# Altium project Tegra_Dual_Camera.PrjPcb (part 1 of 3)
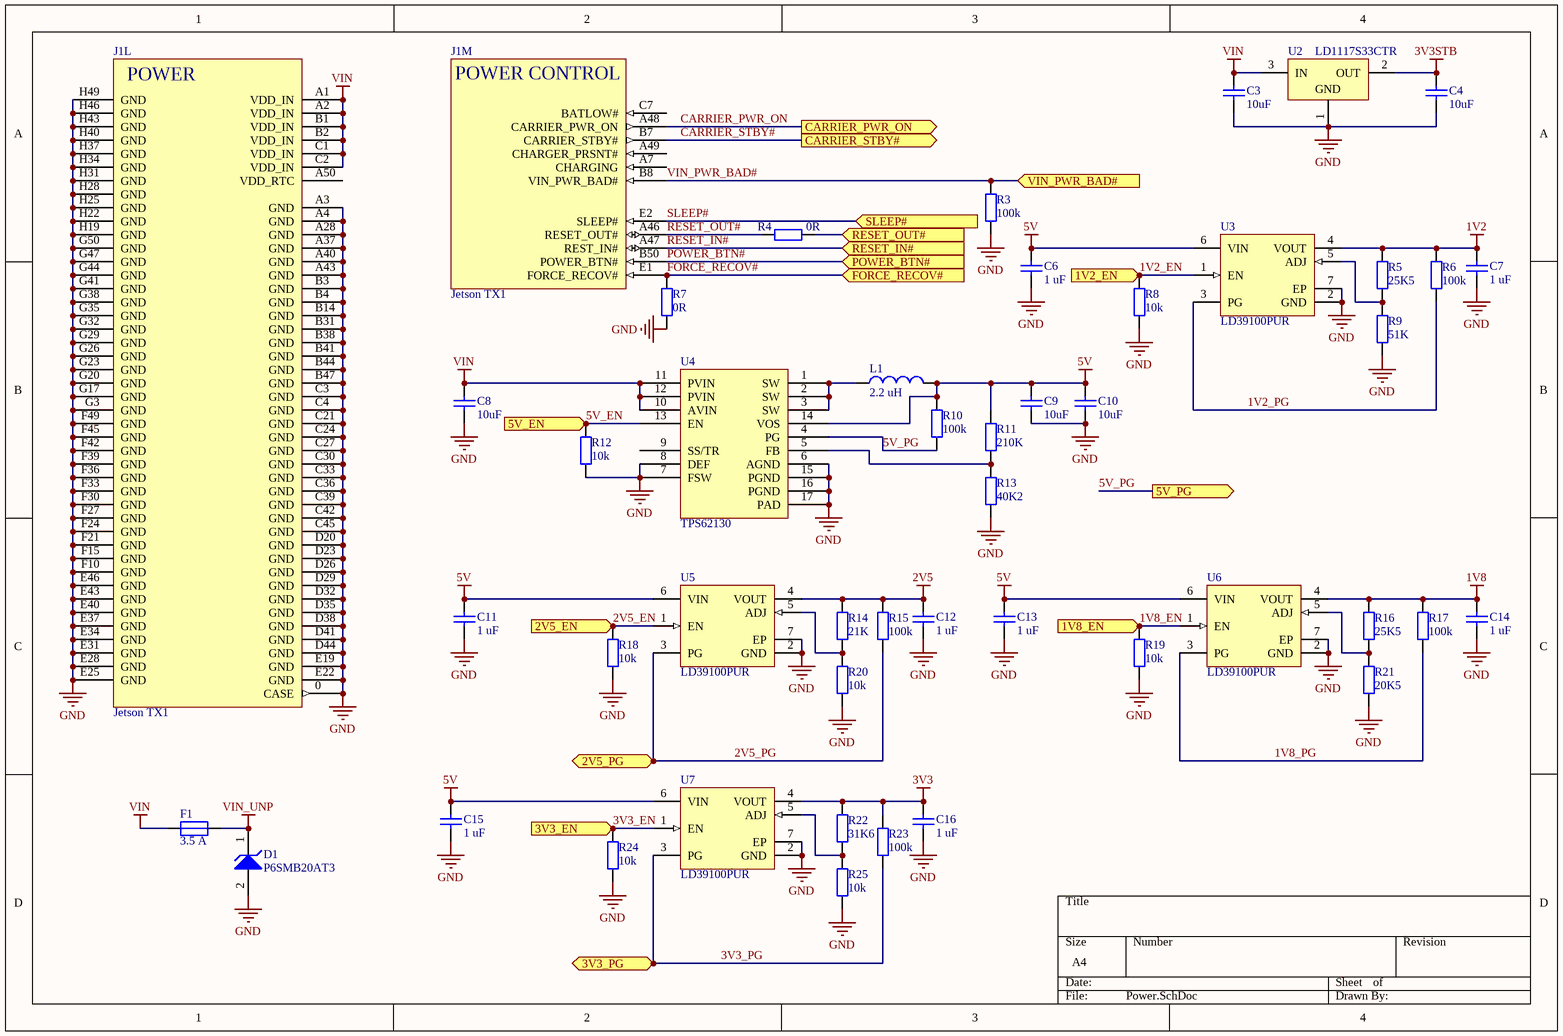
[diagram p0: Power.SchDoc]
16 sheets, 233 parts. Net scope: flat (ports and power ports of the same name join across sheets).
Board files: PCB.PcbDoc, Tegra_Dual_Camera_Panel.PcbDoc
Sheets:
  Power.SchDoc
  Not_Used.SchDoc
  Tegra_CSI.SchDoc
  SD_Card.SchDoc
  Ethernet.SchDoc
  Tegra_Serial.SchDoc
  MCU_CAN.SchDoc
  Debug_connectors.SchDoc
  USB.SchDoc
  Rail_discharge.SchDoc
  LWIR_Camera.SchDoc
  LWIR_FPGA_CSI.SchDoc
  LWIR_FPGA_Misc.SchDoc
  RGB_Camera.SchDoc
  RGB_FPGA_CSI.SchDoc
  RGB_FPGA_Misc.SchDoc

## Sheet Power.SchDoc
size A4

### Parts
C3  value 10uF  [1206_1.6_M]  (hidden comment: TMK316B7106KL-TD)
C4  value 10uF  [0603C_M]  (hidden comment: GRM188R60J106ME47D)
C6  Capacitance: 1 uF  [0603C_M]  (hidden comment: GRM188R61A105KA61D)
C7  Capacitance: 1 uF  [0603C_M]  (hidden comment: GRM188R61A105KA61D)
C8  value 10uF  [1206_1.6_M]  (hidden comment: TMK316B7106KL-TD)
C9  value 10uF  [0603C_M]  (hidden comment: GRM188R60J106ME47D)
C10  value 10uF  [0603C_M]  (hidden comment: GRM188R60J106ME47D)
C11  Capacitance: 1 uF  [0603C_M]  (hidden comment: GRM188R61A105KA61D)
C12  Capacitance: 1 uF  [0603C_M]  (hidden comment: GRM188R61A105KA61D)
C13  Capacitance: 1 uF  [0603C_M]  (hidden comment: GRM188R61A105KA61D)
C14  Capacitance: 1 uF  [0603C_M]  (hidden comment: GRM188R61A105KA61D)
C15  Capacitance: 1 uF  [0603C_M]  (hidden comment: GRM188R61A105KA61D)
C16  Capacitance: 1 uF  [0603C_M]  (hidden comment: GRM188R61A105KA61D)
D1  P6SMB20AT3  [ONSC-SMB-2-403A-03_J_V]
F1  Current Rating: 3.5 A  [0603R_0.45_M]  (hidden comment: 0603SFV350F/32-2)
J1  Jetson TX1  [Nvidia Jetson TX1]  (parts L,M of 14)
L1  Inductance: 2.2 uH  [XFL4020_M]  (hidden comment: XFL4020-222MEC)
R3  Resistance: 100k  [0402R_M]  (hidden comment: CRCW0402100KJNED)
R4  value 0R  [0402R_M]  (hidden comment: Generic resitor)
R5  value 25K5  [0402R_M]  (hidden comment: CRCW040225K5FKED)
R6  Resistance: 100k  [0402R_M]  (hidden comment: CRCW0402100KJNED)
R7  value 0R  [0402R_M]  (hidden comment: Generic resitor)
R8  value 10k  [0402R_M]  (hidden comment: CRCW040210K0FKED)
R9  value 51K  [0402R_M]  (hidden comment: CRCW040251K0FKED)
R10  Resistance: 100k  [0402R_M]  (hidden comment: CRCW0402100KJNED)
R11  value 210K  [0402R_M]  (hidden comment: CRCW0402210KFKED)
R12  value 10k  [0402R_M]  (hidden comment: CRCW040210K0FKED)
R13  value 40K2  [0402R_M]  (hidden comment: CRCW040240K2FKED)
R14  value 21K  [0402R_M]  (hidden comment: CRCW040221K0FKED)
R15  Resistance: 100k  [0402R_M]  (hidden comment: CRCW0402100KJNED)
R16  value 25K5  [0402R_M]  (hidden comment: CRCW040225K5FKED)
R17  Resistance: 100k  [0402R_M]  (hidden comment: CRCW0402100KJNED)
R18  value 10k  [0402R_M]  (hidden comment: CRCW040210K0FKED)
R19  value 10k  [0402R_M]  (hidden comment: CRCW040210K0FKED)
R20  value 10k  [0402R_M]  (hidden comment: CRCW040210K0FKED)
R21  value 20K5  [0402R_M]  (hidden comment: CRCW040220K5FKED)
R22  value 31K6  [0402R_M]  (hidden comment: CRCW040231K6FKED)
R23  Resistance: 100k  [0402R_M]  (hidden comment: CRCW0402100KJNED)
R24  value 10k  [0402R_M]  (hidden comment: CRCW040210K0FKED)
R25  value 10k  [0402R_M]  (hidden comment: CRCW040210K0FKED)
U2  LD1117S33CTR  [SOT-223_L]
U3  LD39100PUR  [DFN6D_M]
U4  TPS62130  [VQFN1_16_L]
U5  LD39100PUR  [DFN6D_M]
U6  LD39100PUR  [DFN6D_M]
U7  LD39100PUR  [DFN6D_M]

### Ports
1V2_EN (in), 1V8_EN (in), 2V5_EN (in), 2V5_PG (out), 3V3_EN (in), 3V3_PG (out), 5V_EN (in), 5V_PG (out), CARRIER_PWR_ON (out), CARRIER_STBY# (out), FORCE_RECOV# (in), POWER_BTN# (in), RESET_IN# (in), RESET_OUT# (in), SLEEP# (in), VIN_PWR_BAD# (in)

### Nets
1V2: C7.2 R5.2 R6.2 U3.4(VOUT)
1V8: C14.2 R16.2 R17.2 U6.4(VOUT)
2V5: C12.2 R14.2 R15.2 U5.4(VOUT)
3V3: C16.2 R22.2 R23.2 U7.4(VOUT)
3V3STB: C4.2 U2.2(OUT)
5V: C6.2 C9.2 C10.2 C11.2 C13.2 C15.2 L1.2 R10.2 R11.2 U3.6(VIN) U4.14(VOS) U5.6(VIN) U6.6(VIN) U7.6(VIN)
GND: C3.1 C4.1 C6.1 C7.1 C8.1 C9.1 C10.1 C11.1 C12.1 C13.1 C14.1 C15.1 C16.1 D1.2(A) J1.0(CASE) J1.A3(GND) J1.A4(GND) J1.A28(GND) J1.A37(GND) J1.A40(GND) J1.A43(GND) J1.B3(GND) J1.B4(GND) J1.B14(GND) J1.B31(GND) J1.B38(GND) J1.B41(GND) J1.B44(GND) J1.B47(GND) J1.C3(GND) J1.C4(GND) J1.C21(GND) J1.C24(GND) J1.C27(GND) J1.C30(GND) J1.C33(GND) J1.C36(GND) J1.C39(GND) J1.C42(GND) J1.C45(GND) J1.D20(GND) J1.D23(GND) J1.D26(GND) J1.D29(GND) J1.D32(GND) J1.D35(GND) J1.D38(GND) J1.D41(GND) J1.D44(GND) J1.E19(GND) J1.E22(GND) J1.E25(GND) J1.E28(GND) J1.E31(GND) J1.E34(GND) J1.E37(GND) J1.E40(GND) J1.E43(GND) J1.E46(GND) J1.F10(GND) J1.F15(GND) J1.F21(GND) J1.F24(GND) J1.F27(GND) J1.F30(GND) J1.F33(GND) J1.F36(GND) J1.F39(GND) J1.F42(GND) J1.F45(GND) J1.F49(GND) J1.G3(GND) J1.G17(GND) J1.G20(GND) J1.G23(GND) J1.G26(GND) J1.G29(GND) J1.G32(GND) J1.G35(GND) J1.G38(GND) J1.G41(GND) J1.G44(GND) J1.G47(GND) J1.G50(GND) J1.H19(GND) J1.H22(GND) J1.H25(GND) J1.H28(GND) J1.H31(GND) J1.H34(GND) J1.H37(GND) J1.H40(GND) J1.H43(GND) J1.H46(GND) J1.H49(GND) R3.1 R7.1 R8.1 R9.1 R12.1 R13.1 R18.1 R19.1 R20.1 R21.1 R24.1 R25.1 U2.1(GND) U3.2(GND) U3.7(EP) U4.6(AGND) U4.7(FSW) U4.8(DEF) U4.15(PGND) U4.16(PGND) U4.17(PAD) U5.2(GND) U5.7(EP) U6.2(GND) U6.7(EP) U7.2(GND) U7.7(EP)
VIN: C3.2 C8.2 F1.1 J1.A1(VDD_IN) J1.A2(VDD_IN) J1.B1(VDD_IN) J1.B2(VDD_IN) J1.C1(VDD_IN) J1.C2(VDD_IN) U2.3(IN) U4.10(AVIN) U4.11(PVIN) U4.12(PVIN)
VIN_UNP: D1.1(K) F1.2
1V2_EN: R8.2 U3.1(EN) ; port 1V2_EN
1V2_PG: R6.1 U3.3(PG)
1V8_EN: R19.2 U6.1(EN) ; port 1V8_EN
1V8_PG: R17.1 U6.3(PG)
2V5_EN: R18.2 U5.1(EN) ; port 2V5_EN
2V5_PG: R15.1 U5.3(PG) ; port 2V5_PG
3V3_EN: R24.2 U7.1(EN) ; port 3V3_EN
3V3_PG: R23.1 U7.3(PG) ; port 3V3_PG
5V_EN: R12.2 U4.13(EN) ; port 5V_EN
5V_PG: R10.1 U4.4(PG) ; port 5V_PG
CARRIER_PWR_ON: J1.A48(CARRIER_PWR_ON) ; port CARRIER_PWR_ON
CARRIER_STBY#: J1.B7(CARRIER_STBY#) ; port CARRIER_STBY#
FORCE_RECOV#: J1.E1(FORCE_RECOV#) R7.2 ; port FORCE_RECOV#
POWER_BTN#: J1.B50(POWER_BTN#) ; port POWER_BTN#
RESET_IN#: J1.A47(REST_IN#) ; port RESET_IN#
RESET_OUT#: J1.A46(RESET_OUT#) R4.1
SLEEP#: J1.E2(SLEEP#) ; port SLEEP#
VIN_PWR_BAD#: J1.B8(VIN_PWR_BAD#) R3.2 ; port VIN_PWR_BAD#
NetL1_1: L1.1 U4.1(SW) U4.2(SW) U4.3(SW)
NetR4_2: R4.2 ; port RESET_OUT#
NetR5_1: R5.1 R9.2 U3.5(ADJ)
NetR11_1: R11.1 R13.2 U4.5(FB)
NetR14_1: R14.1 R20.2 U5.5(ADJ)
NetR16_1: R16.1 R21.2 U6.5(ADJ)
NetR22_1: R22.1 R25.2 U7.5(ADJ)

Not connected (* = marked no-connect by the designer): J1 A7(CHARGING) A49(CHARGER_PRSNT#) A50(VDD_RTC) C7(BATLOW#); U4 9(SS/TR)

### Notes on the sheet
- (in symbol NVIDIA_Jetson_TX1, part L) POWER
- (in symbol NVIDIA_Jetson_TX1, part M) POWER CONTROL

### Library data of the parts
C3 C8 = TMK316B7106KL-TD: CAP CER 1206 10uF 25V X7R 10%; Manufacturer: Taiyo Yuden; Type: Multilayer Ceramic Capacitor; Voltage Rating DC: 25 VDC; Qualification: AEC-Q200; Manufacturer Part Number: TMK316B7106KL-TD; RoHS: RoHS Compliant; Category: Multilayer Ceramic Capacitors MLCC - SMD/SMT; Capacitance: 10 uF; Height: 1.6 mm; Length: 3.2 mm; Package/Case: 1206 (3216 metric); Packaging: Reel; Product: General Type MLCCs; Series: M; Termination Style: SMD/SMT; Tolerance: 10 %; Width: 1.6 mm; Brand: Taiyo Yuden; Case Code - in: 1206; Case Code - mm: 3216; Dielectric: X7R; Maximum Operating Temperature: + 125 C; Minimum Operating Temperature: - 55 C; Standard Pack Qty: 2000; RoHS - Mouser: Y; Minimum Order Quantity: 1; Reeling: True; ComponentLink1URL: http://www.mouser.com/ds/2/396/mlcc_all_e-541559.pdf; ComponentLink1Description: http://www.mouser.com/ds/2/396/mlcc_all_e-541559.pdf
C4 C9 C10 = GRM188R60J106ME47D: CAP CER 10UF 6.3V X5R 0603; Manufacturer: Murata Electronics North America; Tolerance: ±20%; Supplier 1: Digi-Key; Manufacturer Part Number: GRM188R60J106ME47D; RoHS: RoHS Compliant; Category: Capacitors; Stock 1: 13697850; Pricing 1: 1=0.17, 10=0.123, 100=0.0578, 500=0.04052, 1000=0.03355 (USD); Packaging: Cut Tape (CT); Part Status: Active; Voltage - Rated: 6.3V; Temperature Coefficient: X5R; Operating Temperature: -55°C ~ 85°C; Features: -; Ratings: -; Applications: General Purpose; Mounting Type: Surface Mount, MLCC; Package / Case: 0603 (1608 Metric); Size / Dimension: 0.063" L x 0.031" W (1.60mm x 0.80mm); Height - Seated (Max): -; Thickness (Max): 0.035" (0.90mm); Lead Spacing: -; Lead Style: -; ComponentLink1URL: http://www.murata.com/~/media/webrenewal/support/library/catalog/products/capacitor/mlcc/c02e.pdf; ComponentLink1Description: http://www.murata.com/~/media/webrenewal/support/library/catalog/products/capacitor/mlcc/c02e.pdf; Supplier Part Number 1: 490-3896-1-ND
C6 C7 C11-C16 = GRM188R61A105KA61D: CAP CER 1UF 10V X5R 0603; Manufacturer: Murata; Capacitance - nF: 1000 nF; Brand: Murata Electronics; Tolerance: 10 %; Case Height: 0.8 mm; Case Length: 1.6 mm; Temperature Coefficient / Code: +/- 15 %; Type: General Purpose MLCC; Supplier 1: Digi-Key; Manufacturer Part Number: GRM188R61A105KA61D; Stock 1: 2238936; Pricing 1: 1=0.1, 10=0.04, 100=0.0178, 500=0.0127, 1000=0.01 (USD); Dimensions: 0.8 mm W x 1.6 mm L x 0.8 mm H; Product Category: Multilayer Ceramic Capacitors MLCC - SMD/SMT; RoHS: Details; Voltage Rating DC: 10 V; Dielectric: X5R; Case Code - in: 0603; Case Code - mm: 1608; Minimum Operating Temperature: - 55 C; Maximum Operating Temperature: + 85 C; Product: General Type MLCCs; Case Width: 0.8 mm; Operating Temperature Range: - 55 C to + 85 C; Package / Case: 0603 (1608 metric); Packaging: Reel; Series: GRM; Factory Pack Quantity: 4000; Termination Style: SMD/SMT; ComponentLink1URL: https://datasheet.ciiva.com/18102/getdatasheetpartid-85467-18102910.pdf; ComponentLink1Description: https://datasheet.ciiva.com/18102/getdatasheetpartid-85467-18102910.pdf; ComponentLink2URL: https://datasheet.ciiva.com/19476/1857381-19476568.pdf; ComponentLink2Description: https://datasheet.ciiva.com/19476/1857381-19476568.pdf; ComponentLink3URL: https://datasheet.ciiva.com/131/partnumbering-e-01-131743.pdf; ComponentLink3Description: https://datasheet.ciiva.com/131/partnumbering-e-01-131743.pdf; ComponentLink4URL: https://datasheet.ciiva.com/22706/608985-22706782.pdf; ComponentLink4Description: https://datasheet.ciiva.com/22706/608985-22706782.pdf; ComponentLink5URL: https://datasheet.ciiva.com/131/partnumbering-e-01-131742.pdf; ComponentLink5Description: https://datasheet.ciiva.com/131/partnumbering-e-01-131742.pdf; ComponentLink6URL: https://datasheet.ciiva.com/7719/608985-7719036.pdf; ComponentLink6Description: https://datasheet.ciiva.com/7719/608985-7719036.pdf; ComponentLink7URL: https://datasheet.ciiva.com/16199/product-16199724.pdf; ComponentLink7Description: https://datasheet.ciiva.com/16199/product-16199724.pdf; ComponentLink8URL: https://datasheet.ciiva.com/131/partnumbering-e-01-131741.pdf; ComponentLink8Description: https://datasheet.ciiva.com/131/partnumbering-e-01-131741.pdf; Supplier Part Number 1: 490-1543-1-ND; Voltage Rating: 10 V
D1 = CMP-1061-00394-1: 600 W Peak Power Zener Transient Voltage Suppressor, Unidirectional, 2-Pin SMB, Tape and Reel; Manufacturer: On Semiconductor; PPK Max (W): 600; IR Max (uA): 5; V(BR) Typ (V): 20; PartNumber: P6SMB20AT3; Direction: Unidirectional; ComponentLink2URL: http://www.onsemi.com/pub_link/Collateral/P6SMB6.8AT3-D.PDF; PackageVersion: Rev. J, 07/2012; ComponentLink1URL: http://www.onsemi.com/; PackageReference: SMB-2-403A-03_J; Mounting Technology: Surface Mount; DatasheetVersion: Rev. J; ComponentLink2Description: Datasheet; Packing: Tape and Reel; ComponentLink1Description: Manufacturer URL; ComponentLink3Description: Package Specification; ComponentLink3URL: http://www.onsemi.com/pub_link/Collateral/P6SMB6.8AT3-D.PDF; PackageDescription: 2-Pin Small Molded Package, J-Bend Lead, Body 4.33 x 3.625 mm
F1 = 0603SFV350F/32-2: FUSE 0603 3.5A FAST; Manufacturer: TE Connectivity / Raychem; Voltage Rating DC: 32 VDC; Fuse Size / Group: 0603 (1608 metric); Fuse Type: Fast Blow; Interrupt Rating: 35 Amps; Supplier 1: Mouser; Manufacturer Part Number: 0603SFV350F/32-2; RoHS: RoHS Compliant; Category: Surface Mount Fuses; Stock 1: 16912; Pricing 1: 1=0.824, 10=0.621, 100=0.518, 250=0.505, 500=0.427, 1000=0.376, 2500=0.349, 6000=0.337, 12000=0.332 (EUR); Height: 0.51 mm; Length: 1.75 mm; Operating Temperature Range: - 55 C to + 125 C; Packaging: Reel; Product: Surface Mount Fuse; Series: SFV; Width: 0.48 mm; Brand: TE Connectivity / Raychem; Standard Pack Qty: 6000; RoHS - Mouser: Y; Minimum Order Quantity: 1; Reeling: True; ComponentLink1URL: http://www.mouser.com/ds/2/418/NG_CS_CLP00009_A_CLP00009-735180.pdf; ComponentLink1Description: http://www.mouser.com/ds/2/418/NG_CS_CLP00009_A_CLP00009-735180.pdf; Supplier Part Number 1: 650-0603SFV350F/32-2
J1 = NVIDIA_Jetson_TX1: Nvidia computing module
L1 = XFL4020-222MEC: Fixed Inductors Power Inductor 2.2 uH 20 % 8 A / Learn More; Manufacturer: Coilcraft; Part # Aliases: XFL4020-222MEB; Case Height: 2.1 mm; Case Length: 4.3 mm; Core Material: Composite; Maximum DC Current: 8 A; Maximum DC Resistance: 23.5 mOhms; Tolerance: 20 %; Self Resonant Frequency: 38 MHz; Shielding: Shielded; Test Frequency: 100 kHz; Supplier 1: Farnell; Manufacturer Part Number: XFL4020-222MEC; Stock 1: 19632; Pricing 1: 1=2.09, 50=1.81, 100=1.52, 250=1.18 (EUR); Dimensions: 4.3 mm W x 4.3 mm L x 2.1 mm H; Case Width: 4.3 mm; RoHS: Details; Operating Temperature Range: - 40 C to + 125 C; Packaging: Reel; Product: Power Inductors; Termination Style: SMD/SMT; Series: XFL4020; ComponentLink1URL: https://datasheet.ciiva.com/22679/1682010-22679278.pdf; ComponentLink1Description: https://datasheet.ciiva.com/22679/1682010-22679278.pdf; ComponentLink2URL: https://datasheet.ciiva.com/22679/1682010-22679277.pdf; ComponentLink2Description: https://datasheet.ciiva.com/22679/1682010-22679277.pdf; Supplier Part Number 1: 2289216
R3 R6 R10 R15 R17 R23 = CRCW0402100KJNED: RES SMD 100K OHM 5% 1/16W 0402; Manufacturer: Vishay; Brand: Vishay / Dale; Power Rating: 63 mW; Temperature Coefficient: 200 PPM / K; Voltage Rating: 50 V; Unit Weight: 0.000023 oz; Supplier 1: Digi-Key; Manufacturer Part Number: CRCW0402100KJNED; Stock 1: 174; Pricing 1: 1=0.1, 10=0.025, 100=0.01, 1000=0.0045, 2500=0.0039, 5000=0.0032 (USD); Product Category: Thick Film Resistors - SMD; RoHS: Details; Tolerance: 5 %; Case Code - in: 0402; Case Code - mm: 1005; Operating Temperature Range: - 55 C to + 155 C; Series: CRCW; Height: 0.35 mm; Length: 1 mm; Package / Case: 0402 (1005 metric); Packaging: Reel; Product: Thick Film Resistors SMD; Factory Pack Quantity: 10000; Termination Style: SMD/SMT; Width: 0.5 mm; ComponentLink1URL: https://datasheet.ciiva.com/3255/dcrcwe3-3255949.pdf; ComponentLink1Description: https://datasheet.ciiva.com/3255/dcrcwe3-3255949.pdf; ComponentLink2URL: https://datasheet.ciiva.com/28420/dcrcwe3-28420124.pdf; ComponentLink2Description: https://datasheet.ciiva.com/28420/dcrcwe3-28420124.pdf; ComponentLink3URL: https://datasheet.ciiva.com/3255/dcrcwe3-3255950.pdf; ComponentLink3Description: https://datasheet.ciiva.com/3255/dcrcwe3-3255950.pdf; ComponentLink4URL: https://datasheet.ciiva.com/28621/1847332-28621326.pdf; ComponentLink4Description: https://datasheet.ciiva.com/28621/1847332-28621326.pdf; ComponentLink5URL: https://datasheet.ciiva.com/16763/70201119-16763038.pdf; ComponentLink5Description: https://datasheet.ciiva.com/16763/70201119-16763038.pdf; ComponentLink6URL: https://datasheet.ciiva.com/2461/dcrcwe3-2461990.pdf; ComponentLink6Description: https://datasheet.ciiva.com/2461/dcrcwe3-2461990.pdf; ComponentLink7URL: https://datasheet.ciiva.com/2461/dcrcwe3-2461989.pdf; ComponentLink7Description: https://datasheet.ciiva.com/2461/dcrcwe3-2461989.pdf; ComponentLink8URL: https://datasheet.ciiva.com/2461/dcrcwe3-2461991.pdf; ComponentLink8Description: https://datasheet.ciiva.com/2461/dcrcwe3-2461991.pdf; ComponentLink9URL: https://datasheet.ciiva.com/7777/1533075-7777191.pdf; ComponentLink9Description: https://datasheet.ciiva.com/7777/1533075-7777191.pdf; ComponentLink10URL: https://datasheet.ciiva.com/5552/dcrcwe3-109170-5552439.pdf; ComponentLink10Description: https://datasheet.ciiva.com/5552/dcrcwe3-109170-5552439.pdf; Supplier Part Number 1: 541-100KJDKR-ND
R4 R7 = Resistor
R5 R16 = CRCW040225K5FKED: RES SMD 25.5K OHM 1% 1/16W 0402; Manufacturer: Vishay Dale; Power (Watts): 0.063W, 1/16W; Temperature Coefficient: ±100ppm/°C; Supplier 1: Digi-Key; Manufacturer Part Number: CRCW040225K5FKED; RoHS: RoHS Compliant; Category: Resistors; Stock 1: 51405; Pricing 1: 1=0.1, 10=0.037, 100=0.0149, 1000=0.0067, 2500=0.00582, 5000=0.00481 (USD); Packaging: Cut Tape (CT); Part Status: Active; Tolerance: ±1%; Composition: Thick Film; Features: Automotive AEC-Q200; Operating Temperature: -55°C ~ 155°C; Package / Case: 0402 (1005 Metric); Supplier Device Package: 0402; Size / Dimension: 0.039" L x 0.020" W (1.00mm x 0.50mm); Height - Seated (Max): 0.016" (0.40mm); Failure Rate: -; ComponentLink1URL: http://www.vishay.com/docs/20035/dcrcwe3.pdf; ComponentLink1Description: http://www.vishay.com/docs/20035/dcrcwe3.pdf; Supplier Part Number 1: 541-25.5KLCT-ND
R8 R12 R18-R20 R24 R25 = CRCW040210K0FKED: RES SMD 10K OHM 1% 1/16W 0402; Manufacturer: Vishay Dale; Power (Watts): 0.063W, 1/16W; Temperature Coefficient: ±100ppm/°C; Supplier 1: Digi-Key; Manufacturer Part Number: CRCW040210K0FKED; RoHS: RoHS Compliant; Category: Resistors; Stock 1: 0; Pricing 1: 1=0.1, 10=0.037, 100=0.0149, 1000=0.0067, 2500=0.00582, 5000=0.00481 (USD); Packaging: Cut Tape (CT); Part Status: Active; Tolerance: ±1%; Composition: Thick Film; Features: Automotive AEC-Q200; Operating Temperature: -55°C ~ 155°C; Package / Case: 0402 (1005 Metric); Supplier Device Package: 0402; Size / Dimension: 0.039" L x 0.020" W (1.00mm x 0.50mm); Height - Seated (Max): 0.016" (0.40mm); Failure Rate: -; ComponentLink1URL: http://www.vishay.com/docs/20035/dcrcwe3.pdf; ComponentLink1Description: http://www.vishay.com/docs/20035/dcrcwe3.pdf; Supplier Part Number 1: 541-10.0KLCT-ND
R9 = CRCW040251K0FKED: RES SMD 51K OHM 1% 1/16W 0402; Manufacturer: Vishay Dale; Power (Watts): 0.063W, 1/16W; Temperature Coefficient: ±100ppm/°C; Supplier 1: Digi-Key; Manufacturer Part Number: CRCW040251K0FKED; RoHS: RoHS Compliant; Category: Resistors; Stock 1: 5300; Pricing 1: 1=0.1, 10=0.037, 100=0.0149, 1000=0.0067, 2500=0.00582, 5000=0.00481 (USD); Packaging: Cut Tape (CT); Part Status: Active; Tolerance: ±1%; Composition: Thick Film; Features: Automotive AEC-Q200; Operating Temperature: -55°C ~ 155°C; Package / Case: 0402 (1005 Metric); Supplier Device Package: 0402; Size / Dimension: 0.039" L x 0.020" W (1.00mm x 0.50mm); Height - Seated (Max): 0.016" (0.40mm); Failure Rate: -; ComponentLink1URL: http://www.vishay.com/docs/20035/dcrcwe3.pdf; ComponentLink1Description: http://www.vishay.com/docs/20035/dcrcwe3.pdf; Supplier Part Number 1: 541-51.0KLCT-ND
R11 = CRCW0402210KFKED: RES SMD 210K OHM 1% 1/16W 0402; Manufacturer: Vishay Dale; Power (Watts): 0.063W, 1/16W; Temperature Coefficient: ±100ppm/°C; Supplier 1: Digi-Key; Manufacturer Part Number: CRCW0402210KFKED; RoHS: RoHS Compliant; Category: Resistors; Stock 1: 30018; Pricing 1: 1=0.1, 10=0.037, 100=0.0149, 1000=0.0067, 2500=0.00582, 5000=0.00481 (USD); Packaging: Cut Tape (CT); Part Status: Active; Tolerance: ±1%; Composition: Thick Film; Features: Automotive AEC-Q200; Operating Temperature: -55°C ~ 155°C; Package / Case: 0402 (1005 Metric); Supplier Device Package: 0402; Size / Dimension: 0.039" L x 0.020" W (1.00mm x 0.50mm); Height - Seated (Max): 0.016" (0.40mm); Failure Rate: -; ComponentLink1URL: http://www.vishay.com/docs/20035/dcrcwe3.pdf; ComponentLink1Description: http://www.vishay.com/docs/20035/dcrcwe3.pdf; Supplier Part Number 1: 541-210KLCT-ND
R13 = CRCW040240K2FKED: RES SMD 40.2K OHM 1% 1/16W 0402; Manufacturer: Vishay Dale; Power (Watts): 0.063W, 1/16W; Temperature Coefficient: ±100ppm/°C; Supplier 1: Digi-Key; Manufacturer Part Number: CRCW040240K2FKED; RoHS: RoHS Compliant; Category: Resistors; Stock 1: 27736; Pricing 1: 1=0.1, 10=0.037, 100=0.0149, 1000=0.0067, 2500=0.00582, 5000=0.00481 (USD); Packaging: Cut Tape (CT); Part Status: Active; Tolerance: ±1%; Composition: Thick Film; Features: Automotive AEC-Q200; Operating Temperature: -55°C ~ 155°C; Package / Case: 0402 (1005 Metric); Supplier Device Package: 0402; Size / Dimension: 0.039" L x 0.020" W (1.00mm x 0.50mm); Height - Seated (Max): 0.016" (0.40mm); Failure Rate: -; ComponentLink1URL: http://www.vishay.com/docs/20035/dcrcwe3.pdf; ComponentLink1Description: http://www.vishay.com/docs/20035/dcrcwe3.pdf; Supplier Part Number 1: 541-40.2KLCT-ND
R14 = CRCW040221K0FKED: RES SMD 21K OHM 1% 1/16W 0402; Manufacturer: Vishay Dale; Power (Watts): 0.063W, 1/16W; Temperature Coefficient: ±100ppm/°C; Supplier 1: Digi-Key; Manufacturer Part Number: CRCW040221K0FKED; RoHS: RoHS Compliant; Category: Resistors; Stock 1: 0; Pricing 1: 1=0.1, 10=0.037, 100=0.0149, 1000=0.0067, 2500=0.00582, 5000=0.00481 (USD); Packaging: Cut Tape (CT); Part Status: Active; Tolerance: ±1%; Composition: Thick Film; Features: Automotive AEC-Q200; Operating Temperature: -55°C ~ 155°C; Package / Case: 0402 (1005 Metric); Supplier Device Package: 0402; Size / Dimension: 0.039" L x 0.020" W (1.00mm x 0.50mm); Height - Seated (Max): 0.016" (0.40mm); Failure Rate: -; ComponentLink1URL: http://www.vishay.com/docs/20035/dcrcwe3.pdf; ComponentLink1Description: http://www.vishay.com/docs/20035/dcrcwe3.pdf; Supplier Part Number 1: 541-21.0KLCT-ND
R21 = CRCW040220K5FKED: RES SMD 20.5K OHM 1% 1/16W 0402; Manufacturer: Vishay Dale; Power (Watts): 0.063W, 1/16W; Temperature Coefficient: ±100ppm/°C; Supplier 1: Digi-Key; Manufacturer Part Number: CRCW040220K5FKED; RoHS: RoHS Compliant; Category: Resistors; Stock 1: 0; Pricing 1: 1=0.1, 10=0.037, 100=0.0149, 1000=0.0067, 2500=0.00582, 5000=0.00481 (USD); Packaging: Cut Tape (CT); Part Status: Active; Tolerance: ±1%; Composition: Thick Film; Features: Automotive AEC-Q200; Operating Temperature: -55°C ~ 155°C; Package / Case: 0402 (1005 Metric); Supplier Device Package: 0402; Size / Dimension: 0.039" L x 0.020" W (1.00mm x 0.50mm); Height - Seated (Max): 0.016" (0.40mm); Failure Rate: -; ComponentLink1URL: http://www.vishay.com/docs/20035/dcrcwe3.pdf; ComponentLink1Description: http://www.vishay.com/docs/20035/dcrcwe3.pdf; Supplier Part Number 1: 541-20.5KLCT-ND
R22 = CRCW040231K6FKED: RES SMD 31.6K OHM 1% 1/16W 0402; Manufacturer: Vishay Dale; Power (Watts): 0.063W, 1/16W; Temperature Coefficient: ±100ppm/°C; Supplier 1: Digi-Key; Manufacturer Part Number: CRCW040231K6FKED; RoHS: RoHS Compliant; Category: Resistors; Stock 1: 0; Pricing 1: 1=0.1, 10=0.037, 100=0.0149, 1000=0.0067, 2500=0.00582, 5000=0.00481 (USD); Packaging: Cut Tape (CT); Part Status: Active; Tolerance: ±1%; Composition: Thick Film; Features: Automotive AEC-Q200; Operating Temperature: -55°C ~ 155°C; Package / Case: 0402 (1005 Metric); Supplier Device Package: 0402; Size / Dimension: 0.039" L x 0.020" W (1.00mm x 0.50mm); Height - Seated (Max): 0.016" (0.40mm); Failure Rate: -; ComponentLink1URL: http://www.vishay.com/docs/20035/dcrcwe3.pdf; ComponentLink1Description: http://www.vishay.com/docs/20035/dcrcwe3.pdf; Supplier Part Number 1: 541-31.6KLCT-ND
U2 = LD1117S33CTR: IC REG LDO 3.3V 0.8A SOT223; Manufacturer: STMicroelectronics; Regulator Topology: Positive Fixed; Current - Output: 800mA; Voltage - Dropout (Typical): 1.1V @ 800mA; Voltage - Input: Up to 15V; Supplier 1: Digi-Key; Manufacturer Part Number: LD1117S33CTR; RoHS: RoHS Compliant; Category: Integrated Circuits (ICs); Stock 1: 22602; Pricing 1: 1=0.46, 10=0.373, 100=0.2538, 500=0.19034, 1000=0.14276 (USD); Packaging: Cut Tape (CT); Part Status: Active; Voltage - Output: 3.3V; Current - Limit (Min): -; Operating Temperature: -40°C ~ 125°C; Mounting Type: Surface Mount; Package / Case: TO-261-4, TO-261AA; Supplier Device Package: SOT-223; ComponentLink1URL: http://www.st.com/content/ccc/resource/technical/document/datasheet/99/3b/7d/91/91/51/4b/be/CD00000544.pdf/files/CD00000544.pdf/jcr:content/translations/en.CD00000544.pdf; ComponentLink1Description: http://www.st.com/content/ccc/resource/technical/document/datasheet/99/3b/7d/91/91/51/4b/be/CD00000544.pdf/files/CD00000544.pdf/jcr:content/translations/en.CD00000544.pdf; Supplier Part Number 1: 497-1241-1-ND
U3 U5-U7 = CMP-0244-00287-1: 1 A Low Quiescent Current Low Noise Voltage Regulator, Adjustable from 0.8V, 6-Pin VFDFPN, Tape and Reel; ComponentLink1URL: http://www.st.com; ComponentLink1Description: Manufacturer URL; ComponentLink2Description: Datasheet; DatasheetVersion: 1/10/2011; PackageDescription: 6-Pin Plastic, Dual LLP, 3 x 3 mm Body, 0.95 mm Pitch, Exposed Pad; PackageReference: DFN6D; ComponentLink2URL: http://www.st.com/internet/com/TECHNICAL_RESOURCES/TECHNICAL_LITERATURE/DATASHEET/CD00233788.pdf; PackageVersion: 2008
U4 = TPS62130RGTT: IC REG BUCK ADJ 3A SYNC 16QFN; Manufacturer: Texas Instruments; Function: Step-Down; Output Configuration: Positive; Output Type: Adjustable; Number of Outputs: 1; Voltage - Input (Min): 3V; Voltage - Input (Max): 17V; Voltage - Output (Min/Fixed): 0.9V; Voltage - Output (Max): 6V; Frequency - Switching: 2.5MHz; Synchronous Rectifier: Yes; Supplier 1: Digi-Key; Manufacturer Part Number: TPS62130RGTT; RoHS: RoHS Compliant; Category: Integrated Circuits (ICs); Stock 1: 6750; Pricing 1: 250=1.98, 1250=1.13875 (USD); Packaging: Tape & Reel (TR); Part Status: Active; Topology: Buck; Current - Output: 3A; Operating Temperature: -40°C ~ 85°C (TA); Mounting Type: Surface Mount; Package / Case: 16-VFQFN Exposed Pad; Supplier Device Package: 16-QFN (3x3); ComponentLink1URL: http://www.ti.com/lit/ds/symlink/tps62130.pdf; ComponentLink1Description: http://www.ti.com/lit/ds/symlink/tps62130.pdf; Supplier Part Number 1: 296-29934-2-ND

## Sheet Not_Used.SchDoc
size A4
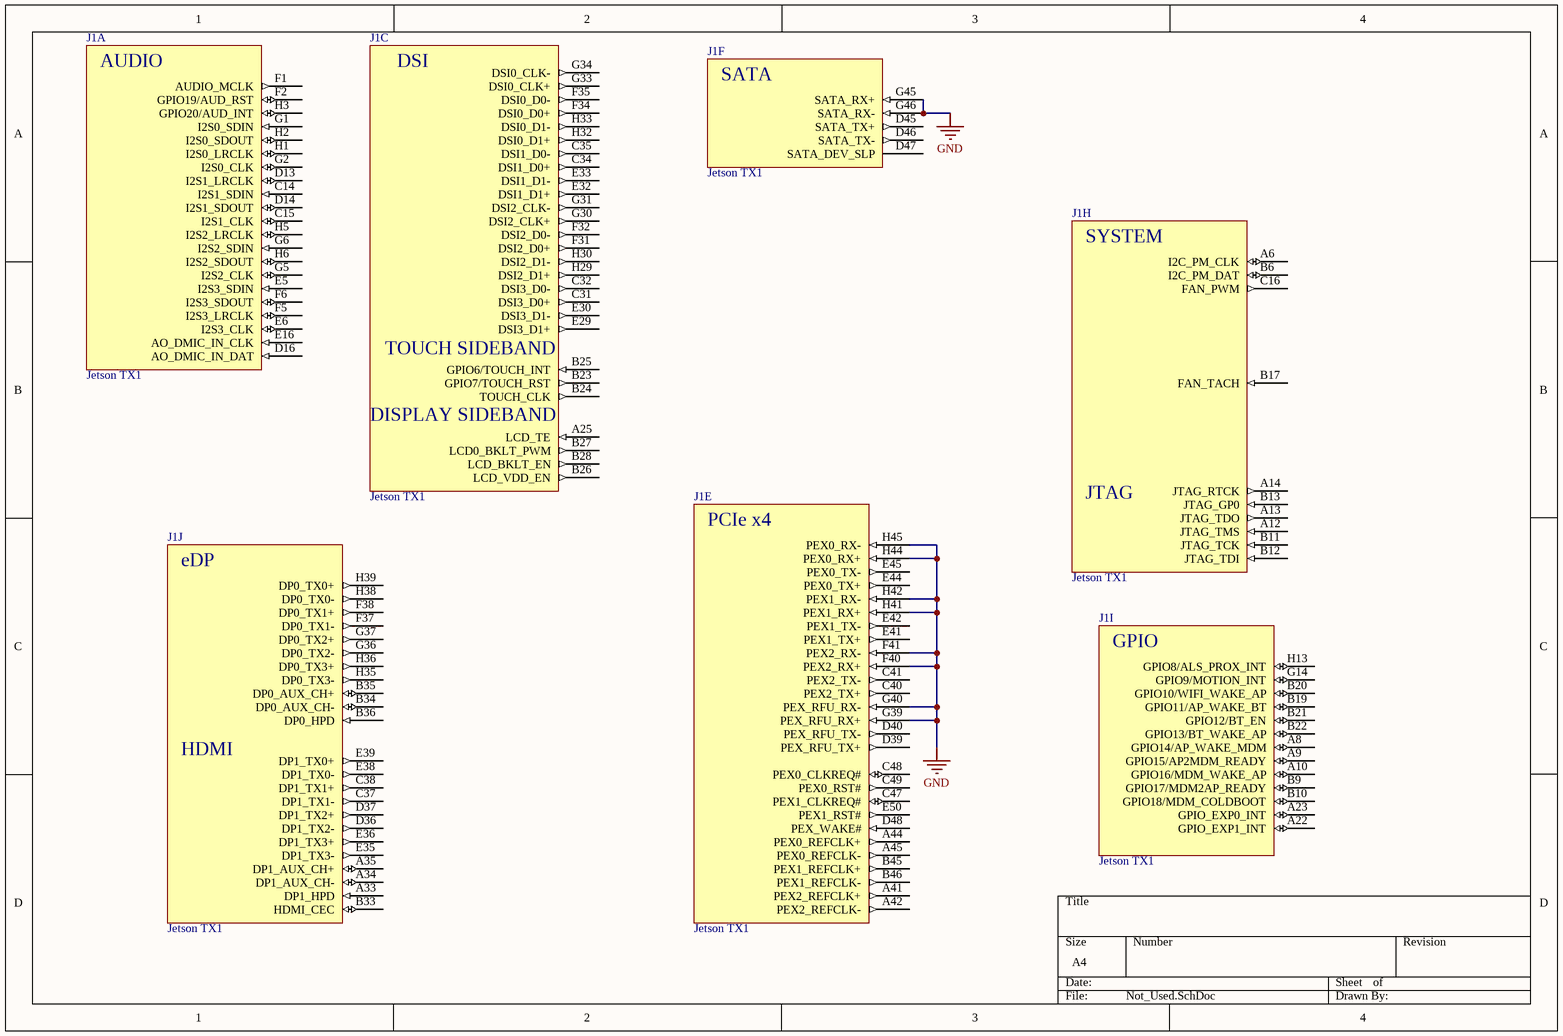
[diagram p1: Not_Used.SchDoc]

### Parts
J1  Jetson TX1  [Nvidia Jetson TX1]  (parts A,C,E,F,H,I,J of 14)

### Nets
GND: J1.F40(PEX2_RX+) J1.F41(PEX2_RX-) J1.G39(PEX_RFU_RX+) J1.G40(PEX_RFU_RX-) J1.G45(SATA_RX+) J1.G46(SATA_RX-) J1.H41(PEX1_RX+) J1.H42(PEX1_RX-) J1.H44(PEX0_RX+) J1.H45(PEX0_RX-)

Not connected (* = marked no-connect by the designer): J1 A6(I2C_PM_CLK) A8(GPIO14/AP_WAKE_MDM) A9(GPIO15/AP2MDM_READY) A10(GPIO16/MDM_WAKE_AP) A12(JTAG_TMS) A13(JTAG_TDO) A14(JTAG_RTCK) A22(GPIO_EXP1_INT) A23(GPIO_EXP0_INT) A25(LCD_TE) A33(DP1_HPD) A34(DP1_AUX_CH-) A35(DP1_AUX_CH+) A41(PEX2_REFCLK+) A42(PEX2_REFCLK-) A44(PEX0_REFCLK+) A45(PEX0_REFCLK-) B6(I2C_PM_DAT) B9(GPIO17/MDM2AP_READY) B10(GPIO18/MDM_COLDBOOT) B11(JTAG_TCK) B12(JTAG_TDI) B13(JTAG_GP0) B17(FAN_TACH) B19(GPIO11/AP_WAKE_BT) B20(GPIO10/WIFI_WAKE_AP) B21(GPIO12/BT_EN) B22(GPIO13/BT_WAKE_AP) B23(GPIO7/TOUCH_RST) B24(TOUCH_CLK) B25(GPIO6/TOUCH_INT) B26(LCD_VDD_EN) B27(LCD0_BKLT_PWM) B28(LCD_BKLT_EN) B33(HDMI_CEC) B34(DP0_AUX_CH-) B35(DP0_AUX_CH+) B36(DP0_HPD) B45(PEX1_REFCLK+) B46(PEX1_REFCLK-) C14(I2S1_SDIN) C15(I2S1_CLK) C16(FAN_PWM) C31(DSI3_D0+) C32(DSI3_D0-) C34(DSI1_D0+) C35(DSI1_D0-) C37(DP1_TX1-) C38(DP1_TX1+) C40(PEX2_TX+) C41(PEX2_TX-) C47(PEX1_CLKREQ#) C48(PEX0_CLKREQ#) C49(PEX0_RST#) D13(I2S1_LRCLK) D14(I2S1_SDOUT) D16(AO_DMIC_IN_DAT) D36(DP1_TX2-) D37(DP1_TX2+) D39(PEX_RFU_TX+) D40(PEX_RFU_TX-) D45(SATA_TX+) D46(SATA_TX-) D47(SATA_DEV_SLP) D48(PEX_WAKE#) E5(I2S3_SDIN) E6(I2S3_CLK) E16(AO_DMIC_IN_CLK) E29(DSI3_D1+) E30(DSI3_D1-) E32(DSI1_D1+) E33(DSI1_D1-) E35(DP1_TX3-) E36(DP1_TX3+) E38(DP1_TX0-) E39(DP1_TX0+) E41(PEX1_TX+) E42(PEX1_TX-) E44(PEX0_TX+) E45(PEX0_TX-) E50(PEX1_RST#) F1(AUDIO_MCLK) F2(GPIO19/AUD_RST) F5(I2S3_LRCLK) F6(I2S3_SDOUT) F31(DSI2_D0+) F32(DSI2_D0-) F34(DSI0_D0+) F35(DSI0_D0-) F37(DP0_TX1-) F38(DP0_TX1+) G1(I2S0_SDIN) G2(I2S0_CLK) G5(I2S2_CLK) G6(I2S2_SDIN) G14(GPIO9/MOTION_INT) G30(DSI2_CLK+) G31(DSI2_CLK-) G33(DSI0_CLK+) G34(DSI0_CLK-) G36(DP0_TX2-) G37(DP0_TX2+) H1(I2S0_LRCLK) H2(I2S0_SDOUT) H3(GPIO20/AUD_INT) H5(I2S2_LRCLK) H6(I2S2_SDOUT) H13(GPIO8/ALS_PROX_INT) H29(DSI2_D1+) H30(DSI2_D1-) H32(DSI0_D1+) H33(DSI0_D1-) H35(DP0_TX3-) H36(DP0_TX3+) H38(DP0_TX0-) H39(DP0_TX0+)

### Notes on the sheet
- (in symbol NVIDIA_Jetson_TX1, part A) AUDIO
- (in symbol NVIDIA_Jetson_TX1, part C) DSI; TOUCH SIDEBAND; DISPLAY SIDEBAND
- (in symbol NVIDIA_Jetson_TX1, part E) PCIe x4
- (in symbol NVIDIA_Jetson_TX1, part F) SATA
- (in symbol NVIDIA_Jetson_TX1, part H) SYSTEM; JTAG
- (in symbol NVIDIA_Jetson_TX1, part I) GPIO
- (in symbol NVIDIA_Jetson_TX1, part J) eDP; HDMI

### Library data of the parts
J1 = NVIDIA_Jetson_TX1: Nvidia computing module

## Sheet Tegra_CSI.SchDoc
size A4
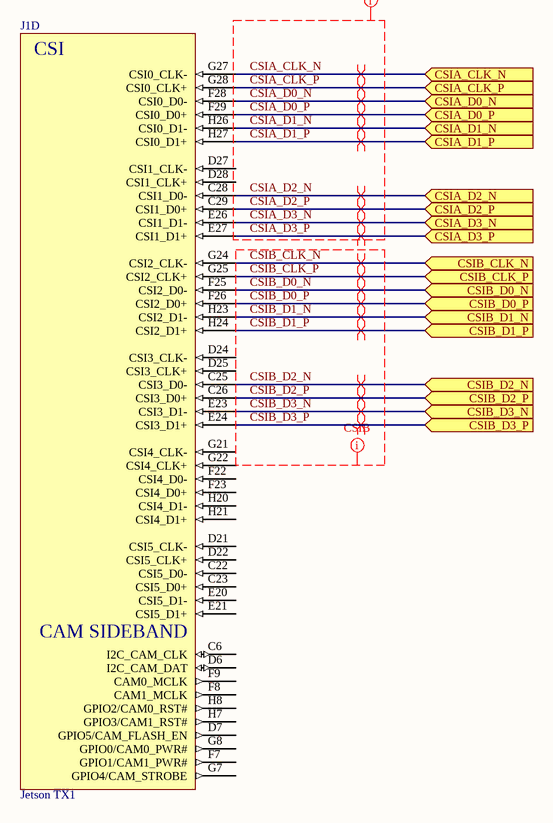
[diagram p2: Tegra_CSI.SchDoc]

### Parts
J1  Jetson TX1  [Nvidia Jetson TX1]  (part D of 14)

### Ports
CSIA_CLK_N (in), CSIA_CLK_P (in), CSIA_D0_N (in), CSIA_D0_P (in), CSIA_D1_N (in), CSIA_D1_P (in), CSIA_D2_N (in), CSIA_D2_P (in), CSIA_D3_N (in), CSIA_D3_P (in), CSIB_CLK_N (in), CSIB_CLK_P (in), CSIB_D0_N (in), CSIB_D0_P (in), CSIB_D1_N (in), CSIB_D1_P (in), CSIB_D2_N (in), CSIB_D2_P (in), CSIB_D3_N (in), CSIB_D3_P (in)

### Nets
CSIA_CLK_N: J1.G27(CSI0_CLK-) ; port CSIA_CLK_N
CSIA_CLK_P: J1.G28(CSI0_CLK+) ; port CSIA_CLK_P
CSIA_D0_N: J1.F28(CSI0_D0-) ; port CSIA_D0_N
CSIA_D0_P: J1.F29(CSI0_D0+) ; port CSIA_D0_P
CSIA_D1_N: J1.H26(CSI0_D1-) ; port CSIA_D1_N
CSIA_D1_P: J1.H27(CSI0_D1+) ; port CSIA_D1_P
CSIA_D2_N: J1.C28(CSI1_D0-) ; port CSIA_D2_N
CSIA_D2_P: J1.C29(CSI1_D0+) ; port CSIA_D2_P
CSIA_D3_N: J1.E26(CSI1_D1-) ; port CSIA_D3_N
CSIA_D3_P: J1.E27(CSI1_D1+) ; port CSIA_D3_P
CSIB_CLK_N: J1.G24(CSI2_CLK-) ; port CSIB_CLK_N
CSIB_CLK_P: J1.G25(CSI2_CLK+) ; port CSIB_CLK_P
CSIB_D0_N: J1.F25(CSI2_D0-) ; port CSIB_D0_N
CSIB_D0_P: J1.F26(CSI2_D0+) ; port CSIB_D0_P
CSIB_D1_N: J1.H23(CSI2_D1-) ; port CSIB_D1_N
CSIB_D1_P: J1.H24(CSI2_D1+) ; port CSIB_D1_P
CSIB_D2_N: J1.C25(CSI3_D0-) ; port CSIB_D2_N
CSIB_D2_P: J1.C26(CSI3_D0+) ; port CSIB_D2_P
CSIB_D3_N: J1.E23(CSI3_D1-) ; port CSIB_D3_N
CSIB_D3_P: J1.E24(CSI3_D1+) ; port CSIB_D3_P

Not connected (* = marked no-connect by the designer): J1 C6(I2C_CAM_CLK) C22(CSI5_D0-) C23(CSI5_D0+) D6(I2C_CAM_DAT) D7(GPIO5/CAM_FLASH_EN) D21(CSI5_CLK-) D22(CSI5_CLK+) D24(CSI3_CLK-) D25(CSI3_CLK+) D27(CSI1_CLK-) D28(CSI1_CLK+) E20(CSI5_D1-) E21(CSI5_D1+) F7(GPIO1/CAM1_PWR#) F8(CAM1_MCLK) F9(CAM0_MCLK) F22(CSI4_D0-) F23(CSI4_D0+) G7(GPIO4/CAM_STROBE) G8(GPIO0/CAM0_PWR#) G21(CSI4_CLK-) G22(CSI4_CLK+) H7(GPIO3/CAM1_RST#) H8(GPIO2/CAM0_RST#) H20(CSI4_D1-) H21(CSI4_D1+)

### Layout directives
differential pair: CSIA_CLK_N, CSIA_CLK_P, CSIA_D0_N, CSIA_D0_P, CSIA_D1_N, CSIA_D1_P, CSIA_D2_N, CSIA_D2_P, CSIA_D3_N, CSIA_D3_P, CSIB_CLK_N, CSIB_CLK_P, CSIB_D0_N, CSIB_D0_P, CSIB_D1_N, CSIB_D1_P, CSIB_D2_N, CSIB_D2_P, CSIB_D3_N, CSIB_D3_P
net class CSIA: CSIA_CLK_N, CSIA_CLK_P, CSIA_D0_N, CSIA_D0_P, CSIA_D1_N, CSIA_D1_P, CSIA_D2_N, CSIA_D2_P, CSIA_D3_N, CSIA_D3_P
net class CSIB: CSIB_CLK_N, CSIB_CLK_P, CSIB_D0_N, CSIB_D0_P, CSIB_D1_N, CSIB_D1_P, CSIB_D2_N, CSIB_D2_P, CSIB_D3_N, CSIB_D3_P

### Notes on the sheet
- (in symbol NVIDIA_Jetson_TX1, part D) CSI; CAM SIDEBAND

### Library data of the parts
J1 = NVIDIA_Jetson_TX1: Nvidia computing module

## Sheet SD_Card.SchDoc
size A4
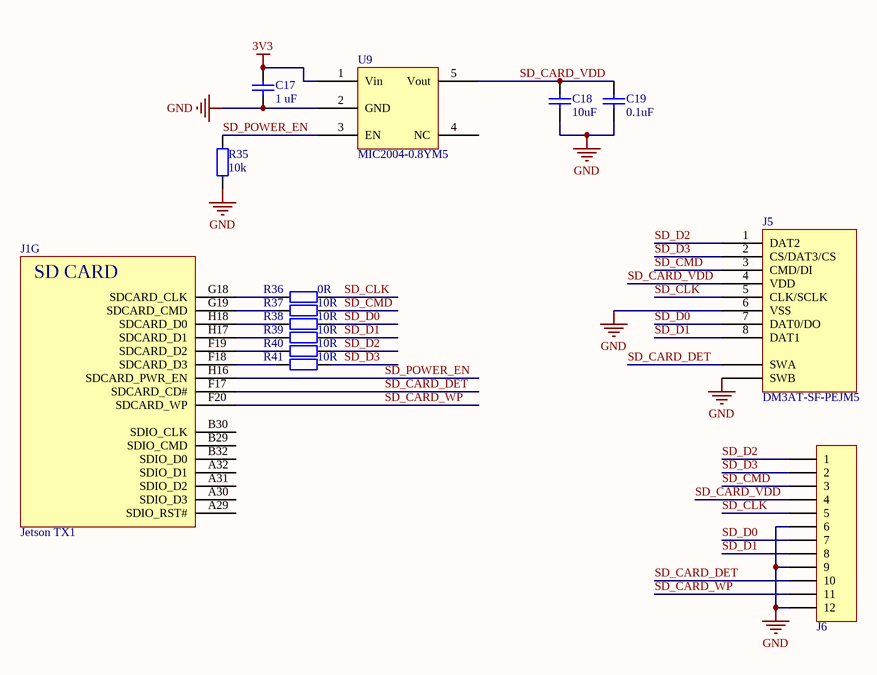
[diagram p3: SD_Card.SchDoc]

### Parts
C17  Capacitance: 1 uF  [0603C_M]  (hidden comment: GRM188R61A105KA61D)
C18  value 10uF  [0603C_M]  (hidden comment: GRM188R60J106ME47D)
C19  Capacitance: 0.1uF  [0402C_M]  (hidden comment: GRM155R71C104KA88D)
J1  Jetson TX1  [Nvidia Jetson TX1]  (part G of 14)
J5  DM3AT-SF-PEJM5  [DM3AT-SF-PEJM5]
J6  0527451297  [52745-1297]  (value not drawn)
R35  value 10k  [0402R_M]  (hidden comment: CRCW040210K0FKED)
R36  value 0R  [0402R_M]  (hidden comment: Generic resitor)
R37  value 10R  [0402R_M]  (hidden comment: CRCW040210R0FKED)
R38  value 10R  [0402R_M]  (hidden comment: CRCW040210R0FKED)
R39  value 10R  [0402R_M]  (hidden comment: CRCW040210R0FKED)
R40  value 10R  [0402R_M]  (hidden comment: CRCW040210R0FKED)
R41  value 10R  [0402R_M]  (hidden comment: CRCW040210R0FKED)
U9  MIC2004-0.8YM5  [SOT23_M5_M]

### Nets
3V3: C17.2 U9.1(Vin)
GND: C17.1 C18.1 C19.1 J5.6(VSS) J5.SWB J6.6 J6.9 J6.12 R35.1 U9.2(GND)
SD_CARD_DET: J1.F17(SDCARD_CD#) J5.SWA J6.10
SD_CARD_VDD: C18.2 C19.2 J5.4(VDD) J6.4 U9.5(Vout)
SD_CARD_WP: J1.F20(SDCARD_WP) J6.11
SD_CLK: J5.5(CLK/SCLK) J6.5 R36.2
SD_CMD: J5.3(CMD/DI) J6.3 R37.2
SD_D0: J5.7(DAT0/DO) J6.7 R38.2
SD_D1: J5.8(DAT1) J6.8 R39.2
SD_D2: J5.1(DAT2) J6.1 R40.2
SD_D3: J5.2(CS/DAT3/CS) J6.2 R41.2
SD_POWER_EN: J1.H16(SDCARD_PWR_EN) R35.2 U9.3(EN)
NetJ1_F18: J1.F18(SDCARD_D3) R41.1
NetJ1_F19: J1.F19(SDCARD_D2) R40.1
NetJ1_G18: J1.G18(SDCARD_CLK) R36.1
NetJ1_G19: J1.G19(SDCARD_CMD) R37.1
NetJ1_H17: J1.H17(SDCARD_D1) R39.1
NetJ1_H18: J1.H18(SDCARD_D0) R38.1

Not connected (* = marked no-connect by the designer): J1 A29(SDIO_RST#) A30(SDIO_D3) A31(SDIO_D2) A32(SDIO_D1) B29(SDIO_CMD) B30(SDIO_CLK) B32(SDIO_D0); U9 4(NC)

### Notes on the sheet
- (in symbol NVIDIA_Jetson_TX1, part G) SD CARD

### Library data of the parts
C17 = GRM188R61A105KA61D: as C6 on sheet Power; Supplier 1: Digi-Key; Manufacturer Part Number: GRM188R61A105KA61D; Stock 1: 2238936; Pricing 1: 1=0.1, 10=0.04, 100=0.0178, 500=0.0127, 1000=0.01 (USD); Dimensions: 0.8 mm W x 1.6 mm L x 0.8 mm H; Product Category: Multilayer Ceramic Capacitors MLCC - SMD/SMT; RoHS: Details; Voltage Rating DC: 10 V; Dielectric: X5R; Case Code - in: 0603; Case Code - mm: 1608; Minimum Operating Temperature: - 55 C; Maximum Operating Temperature: + 85 C; Product: General Type MLCCs; Case Width: 0.8 mm; Operating Temperature Range: - 55 C to + 85 C; Package / Case: 0603 (1608 metric); Packaging: Reel; Series: GRM; Factory Pack Quantity: 4000; Termination Style: SMD/SMT; ComponentLink1URL: https://datasheet.ciiva.com/18102/getdatasheetpartid-85467-18102910.pdf; ComponentLink1Description: https://datasheet.ciiva.com/18102/getdatasheetpartid-85467-18102910.pdf; ComponentLink2URL: https://datasheet.ciiva.com/19476/1857381-19476568.pdf; ComponentLink2Description: https://datasheet.ciiva.com/19476/1857381-19476568.pdf; ComponentLink3URL: https://datasheet.ciiva.com/131/partnumbering-e-01-131743.pdf; ComponentLink3Description: https://datasheet.ciiva.com/131/partnumbering-e-01-131743.pdf; ComponentLink4URL: https://datasheet.ciiva.com/22706/608985-22706782.pdf; ComponentLink4Description: https://datasheet.ciiva.com/22706/608985-22706782.pdf; ComponentLink5URL: https://datasheet.ciiva.com/131/partnumbering-e-01-131742.pdf; ComponentLink5Description: https://datasheet.ciiva.com/131/partnumbering-e-01-131742.pdf; ComponentLink6URL: https://datasheet.ciiva.com/7719/608985-7719036.pdf; ComponentLink6Description: https://datasheet.ciiva.com/7719/608985-7719036.pdf; ComponentLink7URL: https://datasheet.ciiva.com/16199/product-16199724.pdf; ComponentLink7Description: https://datasheet.ciiva.com/16199/product-16199724.pdf; ComponentLink8URL: https://datasheet.ciiva.com/131/partnumbering-e-01-131741.pdf; ComponentLink8Description: https://datasheet.ciiva.com/131/partnumbering-e-01-131741.pdf; Supplier Part Number 1: 490-1543-1-ND; Voltage Rating: 10 V
C18 = GRM188R60J106ME47D: as C4 on sheet Power; Supplier 1: Digi-Key; Manufacturer Part Number: GRM188R60J106ME47D; RoHS: RoHS Compliant; Category: Capacitors; Stock 1: 13697850; Pricing 1: 1=0.17, 10=0.123, 100=0.0578, 500=0.04052, 1000=0.03355 (USD); Packaging: Cut Tape (CT); Part Status: Active; Voltage - Rated: 6.3V; Temperature Coefficient: X5R; Operating Temperature: -55°C ~ 85°C; Features: -; Ratings: -; Applications: General Purpose; Mounting Type: Surface Mount, MLCC; Package / Case: 0603 (1608 Metric); Size / Dimension: 0.063" L x 0.031" W (1.60mm x 0.80mm); Height - Seated (Max): -; Thickness (Max): 0.035" (0.90mm); Lead Spacing: -; Lead Style: -; ComponentLink1URL: http://www.murata.com/~/media/webrenewal/support/library/catalog/products/capacitor/mlcc/c02e.pdf; ComponentLink1Description: http://www.murata.com/~/media/webrenewal/support/library/catalog/products/capacitor/mlcc/c02e.pdf; Supplier Part Number 1: 490-3896-1-ND
C19 = GRM155R71C104KA88D: CAP CER 0.1UF 16V X7R 0402; Manufacturer: Murata Electronics North America; Tolerance: ±10%; Supplier 1: Digi-Key; Manufacturer Part Number: GRM155R71C104KA88D; RoHS: RoHS Compliant; Category: Capacitors; Stock 1: 58190082; Pricing 1: 1=0.1, 10=0.013, 100=0.0059, 500=0.00422, 1000=0.00332, 2500=0.00302, 5000=0.00278 (USD); Packaging: Cut Tape (CT); Part Status: Active; Voltage - Rated: 16V; Temperature Coefficient: X7R; Operating Temperature: -55°C ~ 125°C; Features: -; Ratings: -; Applications: General Purpose; Mounting Type: Surface Mount, MLCC; Package / Case: 0402 (1005 Metric); Size / Dimension: 0.039" L x 0.020" W (1.00mm x 0.50mm); Height - Seated (Max): -; Thickness (Max): 0.022" (0.55mm); Lead Spacing: -; Lead Style: -; ComponentLink1URL: http://www.murata.com/~/media/webrenewal/support/library/catalog/products/capacitor/mlcc/c02e.ashx; ComponentLink1Description: http://www.murata.com/~/media/webrenewal/support/library/catalog/products/capacitor/mlcc/c02e.ashx; Supplier Part Number 1: 490-3261-1-ND
J1 = NVIDIA_Jetson_TX1: Nvidia computing module
J5 = DM3AT-SF-PEJM5: CONN MICRO SD CARD PUSH-PUSH R/A; Manufacturer: Hirose Electric (HRS); Product Training Modules: DM3 Series microSD Card Sockets; Featured Product: DM3AT Series; HTML Datasheet: DM3 Series microSD.html; Card Type: Secure Digital - microSD™; Number of Positions: 10 (8 + 2); Connector Type: Connector and Ejector; Insertion, Removal Method: Push In, Push Out; Online Catalog: DM3 Series; Other Names: HR1964CT; Supplier 1: Digi-Key; Manufacturer Part Number: DM3AT-SF-PEJM5; Stock 1: 32079; Pricing 1: 1=2.88, 10=2.614, 25=2.454, 50=2.3474, 100=2.2407, 250=2.0273, 500=1.8673 (USD); Standard Package: 1; Category: Connectors, Interconnects; Family: Memory Connectors - PC Card Sockets; Series: DM3; Packaging: Cut Tape (CT); Ejector Side: -; Mounting Type: Surface Mount, Right Angle; Features: Switch; Height Above Board: 0.066" (1.68mm); Mounting Feature: Normal, Standard - Top; Contact Finish: Gold; Contact Finish Thickness: -; ComponentLink1URL: https://datasheet.ciiva.com/46418/1697167-46418262.pdf; ComponentLink1Description: https://datasheet.ciiva.com/46418/1697167-46418262.pdf; ComponentLink2URL: https://datasheet.ciiva.com/3122/e60900232-3122534.pdf; ComponentLink2Description: https://datasheet.ciiva.com/3122/e60900232-3122534.pdf; ComponentLink3URL: https://datasheet.ciiva.com/16205/e60900232-16205727.pdf; ComponentLink3Description: https://datasheet.ciiva.com/16205/e60900232-16205727.pdf; ComponentLink4URL: https://datasheet.ciiva.com/16655/e60900232-16655643.pdf; ComponentLink4Description: https://datasheet.ciiva.com/16655/e60900232-16655643.pdf; ComponentLink5URL: https://datasheet.ciiva.com/683/e60900232-683394.pdf; ComponentLink5Description: https://datasheet.ciiva.com/683/e60900232-683394.pdf; ComponentLink6URL: https://datasheet.ciiva.com/683/e60900232-683393.pdf; ComponentLink6Description: https://datasheet.ciiva.com/683/e60900232-683393.pdf; ComponentLink7URL: https://datasheet.ciiva.com/46418/1697167-46418261.pdf; ComponentLink7Description: https://datasheet.ciiva.com/46418/1697167-46418261.pdf; ComponentLink8URL: https://datasheet.ciiva.com/683/e60900232-683395.pdf; ComponentLink8Description: https://datasheet.ciiva.com/683/e60900232-683395.pdf; Supplier Part Number 1: HR1964DKR-ND
J6 = 0527451297: CONN FFC TOP 12POS 0.50MM R/A; Manufacturer: Molex, LLC; Connector/Contact Type: Contacts, Top; Number of Positions: 12; Pitch: 0.020" (0.50mm); FFC, FCB Thickness: 0.30mm; Locking Feature: Slide Lock; Cable End Type: Straight; Voltage Rating: 50V; Current Rating: 0.5A; Mating Cycles: 20; Supplier 1: Digi-Key; Manufacturer Part Number: 0527451297; RoHS: RoHS Compliant; Category: Connectors, Interconnects; Stock 1: 6854; Pricing 1: 1=1.4, 10=1.234, 25=1.1616, 50=1.1132, 100=1.0648, 250=0.968, 500=0.8712 (USD); Packaging: Cut Tape (CT); Part Status: Active; Flat Flex Type: -; Mounting Type: Surface Mount, Right Angle; Termination: Solder; Height Above Board: 0.079" (2.00mm); Contact Material: Phosphor Bronze; Contact Finish: Gold; Housing Material: Polyamide (PA46), Nylon 4/6, Glass Filled; Actuator Material: -; Features: Solder Retention, Zero Insertion Force (ZIF); Operating Temperature: -20°C ~ 85°C; Material Flammability Rating: -; Contact Finish Thickness: -; Housing Color: -; Actuator Color: -; ComponentLink1URL: http://www.molex.com/pdm_docs/sd/527451297_sd.pdf; ComponentLink1Description: http://www.molex.com/pdm_docs/sd/527451297_sd.pdf; Supplier Part Number 1: WM6767CT-ND
R35 = CRCW040210K0FKED: as R8 on sheet Power; Supplier 1: Digi-Key; Manufacturer Part Number: CRCW040210K0FKED; RoHS: RoHS Compliant; Category: Resistors; Stock 1: 0; Pricing 1: 1=0.1, 10=0.037, 100=0.0149, 1000=0.0067, 2500=0.00582, 5000=0.00481 (USD); Packaging: Cut Tape (CT); Part Status: Active; Tolerance: ±1%; Composition: Thick Film; Features: Automotive AEC-Q200; Operating Temperature: -55°C ~ 155°C; Package / Case: 0402 (1005 Metric); Supplier Device Package: 0402; Size / Dimension: 0.039" L x 0.020" W (1.00mm x 0.50mm); Height - Seated (Max): 0.016" (0.40mm); Failure Rate: -; ComponentLink1URL: http://www.vishay.com/docs/20035/dcrcwe3.pdf; ComponentLink1Description: http://www.vishay.com/docs/20035/dcrcwe3.pdf; Supplier Part Number 1: 541-10.0KLCT-ND
R36 = Resistor
R37-R41 = CRCW040210R0FKED: RES SMD 10 OHM 1% 1/16W 0402; Manufacturer: Vishay Dale; Power (Watts): 0.063W, 1/16W; Temperature Coefficient: ±100ppm/°C; Supplier 1: Digi-Key; Manufacturer Part Number: CRCW040210R0FKED; RoHS: RoHS Compliant; Category: Resistors; Stock 1: 0; Pricing 1: 1=0.1, 10=0.037, 100=0.0149, 1000=0.0067, 2500=0.00582, 5000=0.00481 (USD); Packaging: Cut Tape (CT); Part Status: Active; Tolerance: ±1%; Composition: Thick Film; Features: Automotive AEC-Q200; Operating Temperature: -55°C ~ 155°C; Package / Case: 0402 (1005 Metric); Supplier Device Package: 0402; Size / Dimension: 0.039" L x 0.020" W (1.00mm x 0.50mm); Height - Seated (Max): 0.016" (0.40mm); Failure Rate: -; ComponentLink1URL: http://www.vishay.com/docs/20035/dcrcwe3.pdf; ComponentLink1Description: http://www.vishay.com/docs/20035/dcrcwe3.pdf; Supplier Part Number 1: 541-10.0LCT-ND
U9 = MIC2004-0.8YM5: IC DISTRIBUTION SW 0.8A SOT23-5; Manufacturer: Microchip Technology; Switch Type: General Purpose; Number of Outputs: 1; Ratio - Input:Output: 1:1; Output Configuration: High Side; Output Type: P-Channel; Interface: On/Off; Voltage - Load: 2.5 V ~ 5.5 V; Voltage - Supply (Vcc/Vdd): Not Required; Current - Output (Max): 800mA; Rds On (Typ): 70 mOhm; Input Type: Non-Inverting; Fault Protection: Current Limiting (Fixed), Over Temperature; Supplier 1: Digi-Key; Manufacturer Part Number: MIC2004-0.8YM5; RoHS: RoHS Compliant; Category: Integrated Circuits (ICs); Stock 1: 0; Pricing 1: 1050=0 (USD); Packaging: Tube; Part Status: Obsolete; Features: Load Discharge; Operating Temperature: -40°C ~ 85°C (TA); Package / Case: SC-74A, SOT-753; Supplier Device Package: SOT-23-5; ComponentLink1URL: http://www.microchip.com/mymicrochip/filehandler.aspx?ddocname=en579487; ComponentLink1Description: http://www.microchip.com/mymicrochip/filehandler.aspx?ddocname=en579487; Supplier Part Number 1: MIC2004-0.8YM5-ND

## Sheet Ethernet.SchDoc
size A4
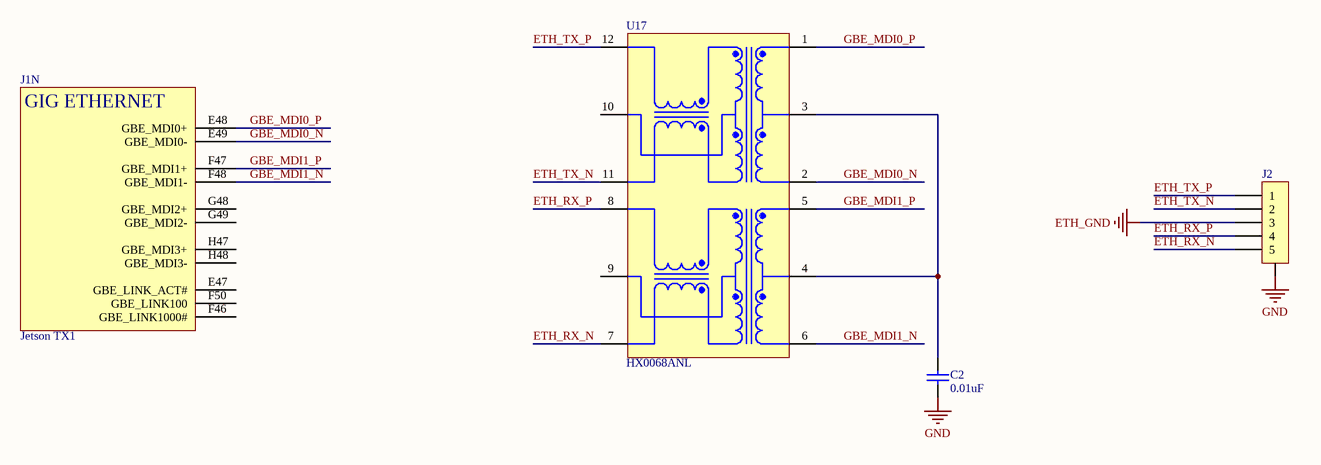
[diagram p4: Ethernet.SchDoc]

### Parts
C2  value 0.01uF  [0402C_M]  (hidden comment: GRM155R71H103KA88D)
J1  Jetson TX1  [Nvidia Jetson TX1]  (part N of 14)
J2  SM05B-GHS-TB(LF)(SN)  [SM05B-GHS-TB]  (value not drawn)
U17  HX0068ANL  [PULS-HX0068ANL_V]

### Nets
ETH_GND: J2.3
GND: C2.1 J2.0
ETH_RX_N: J2.5 U17.7(TX-)
ETH_RX_P: J2.4 U17.8(TX+)
ETH_TX_N: J2.2 U17.11(RX-)
ETH_TX_P: J2.1 U17.12(RX+)
GBE_MDI0_N: J1.E49(GBE_MDI0-) U17.2(RD-)
GBE_MDI0_P: J1.E48(GBE_MDI0+) U17.1(RD+)
GBE_MDI1_N: J1.F48(GBE_MDI1-) U17.6(TD-)
GBE_MDI1_P: J1.F47(GBE_MDI1+) U17.5(TD+)
NetC2_2: C2.2 U17.3(RDCT) U17.4(TDCT)

Not connected (* = marked no-connect by the designer): J1 E47(GBE_LINK_ACT#) F46(GBE_LINK1000#) F50(GBE_LINK100) G48(GBE_MDI2+) G49(GBE_MDI2-) H47(GBE_MDI3+) H48(GBE_MDI3-); U17 9(TXCT) 10(RXCT)

### Notes on the sheet
- (in symbol NVIDIA_Jetson_TX1, part N) GIG ETHERNET

### Library data of the parts
C2 = GRM155R71H103KA88D: CAP CER 0.01uF 50V X7R 0402; Manufacturer: Murata Electronics North America; Tolerance: ±10%; Supplier 1: Digi-Key; Manufacturer Part Number: GRM155R71H103KA88D; RoHS: RoHS Compliant; Category: Capacitors; Stock 1: 10436079; Pricing 1: 1=0.1, 10=0.011, 100=0.005, 500=0.00354, 1000=0.00278, 2500=0.00253, 5000=0.00233 (USD); Packaging: Cut Tape (CT); Part Status: Active; Voltage - Rated: 50V; Temperature Coefficient: X7R; Operating Temperature: -55°C ~ 125°C; Features: -; Ratings: -; Applications: General Purpose; Mounting Type: Surface Mount, MLCC; Package / Case: 0402 (1005 Metric); Size / Dimension: 0.039" L x 0.020" W (1.00mm x 0.50mm); Height - Seated (Max): -; Thickness (Max): 0.022" (0.55mm); Lead Spacing: -; Lead Style: -; ComponentLink1URL: http://www.murata.com/~/media/webrenewal/support/library/catalog/products/capacitor/mlcc/c02e.pdf; ComponentLink1Description: http://www.murata.com/~/media/webrenewal/support/library/catalog/products/capacitor/mlcc/c02e.pdf; Supplier Part Number 1: 490-4516-1-ND
J1 = NVIDIA_Jetson_TX1: Nvidia computing module
J2 = SM05B-GHS-TB(LF)(SN): CONN HEADER GH SIDE 5POS 1.25MM; Manufacturer: JST Sales America Inc.; Pitch - Mating: 0.049" (1.25mm); Number of Positions: 5; Number of Positions Loaded: All; Style: Board to Cable/Wire; Shrouding: Shrouded - 4 Wall; Material Flammability Rating: UL94 V-0; Current Rating: 1A; Voltage Rating: 50V; Mated Stacking Heights: 4.35mm; Supplier 1: Digi-Key; Manufacturer Part Number: SM05B-GHS-TB(LF)(SN); RoHS: RoHS Compliant; Category: Connectors, Interconnects; Stock 1: 49982; Pricing 1: 1=0.48, 10=0.445, 100=0.3415, 500=0.29698, 1000=0.24501 (USD); Packaging: Cut Tape (CT); Part Status: Active; Connector Type: Header; Contact Type: Outer Shroud Contact; Number of Rows: 1; Row Spacing - Mating: -; Mounting Type: Surface Mount, Right Angle; Termination: Solder; Fastening Type: Locking Ramp; Contact Length - Mating: -; Contact Length - Post: -; Overall Contact Length: -; Insulation Height: 0.167" (4.25mm); Contact Shape: Rectangular; Contact Finish - Mating: Tin; Contact Finish Thickness - Mating: -; Contact Finish - Post: Tin; Contact Material: Phosphor Bronze; Insulation Material: Polyamide (PA9T), Nylon 9T; Features: Solder Retention; Operating Temperature: -25°C ~ 85°C; Ingress Protection: -; Insulation Color: Natural; Contact Finish Thickness - Post: -; Applications: -; ComponentLink1URL: http://www.jst-mfg.com/product/pdf/eng/eGH.pdf; ComponentLink1Description: http://www.jst-mfg.com/product/pdf/eng/eGH.pdf; Supplier Part Number 1: 455-1567-1-ND
U17 = CMP-2000-06430-1: 10 / 100 PC Card LAN Magnetic Module, -40 to 85 degC, 12-Pin SMD, RoHS, Tube; Isolation Voltage: 1.5kV; Brand: Pulse; Frequency Range: 100kHzto100MHz; Number of Channels: Single; Packaging: Tube; Datasheet URL: https://productfinder.pulseeng.com/doc_type/WEB301/doc_num/H304/doc_part/H304.pdf; Operating Temperature Range: -40Cto+85C; Product: LAN; Product Type: 10/100PCCardLanMagneticModule; Package Description: 12-Pin Surface Mount Device, Body 12.7 x 8.814 mm, Pitch 1.27 mm; Type: Module; Application: 10/100PCCard; RoHS: True; Width: 9.652mm; Datasheet Version: 10/2013; Product Category: Audio&SignalTransformers; Mounting Technology: SurfaceMount; Length: 12.7mm; Manufacturer: Pulse; Package Reference: HX0068ANL; Height: 2.083mm; Manufacturer URL: http://www.pulseelectronics.com/; Termination Style: SMD/SMT